# EAGLE design LED7R (EAGLE 5.04)
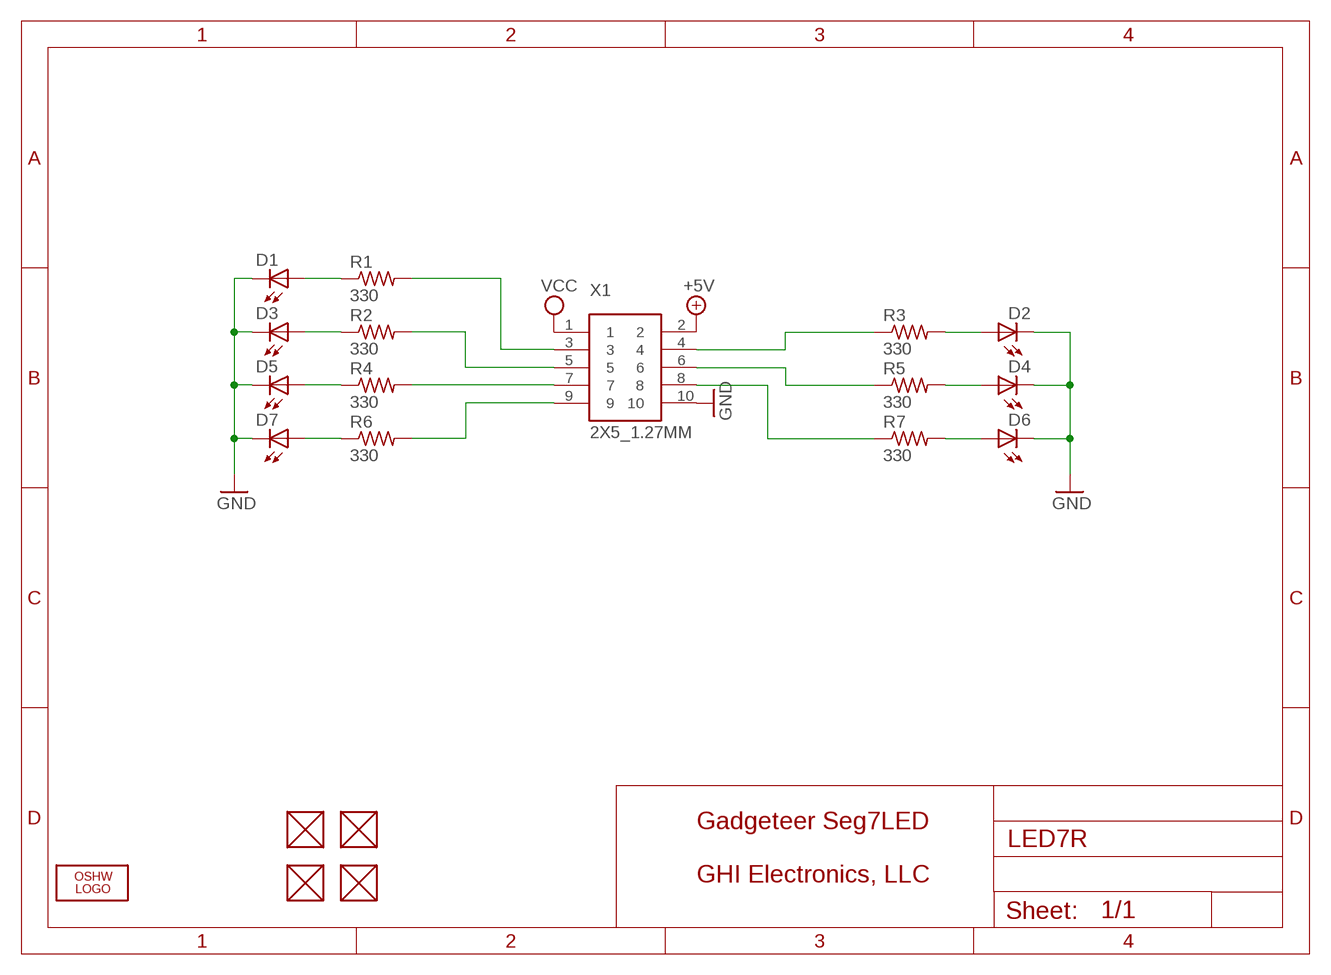
[diagram p0: schematic, sheet 1]

## Parts
D1  LEDCHIPLED_0805  [CHIPLED_0805]
D2  LEDCHIPLED_0805  [CHIPLED_0805]
D3  LEDCHIPLED_0805  [CHIPLED_0805]
D4  LEDCHIPLED_0805  [CHIPLED_0805]
D5  LEDCHIPLED_0805  [CHIPLED_0805]
D6  LEDCHIPLED_0805  [CHIPLED_0805]
D7  LEDCHIPLED_0805  [CHIPLED_0805]
FUD1  FIDUCIAL  [FIDUCIAL_40MIL]
FUD2  FIDUCIAL  [FIDUCIAL_40MIL]
FUD5  FIDUCIAL  [FIDUCIAL_40MIL]
FUD6  FIDUCIAL  [FIDUCIAL_40MIL]
LOGO1  LOGO-OSHW-FILLX0200-NT  [OSHW_FILLX200_NOTEXT]
R1  330  R-US_R0603  [R0603]
R2  330  R-US_R0603  [R0603]
R3  330  R-US_R0603  [R0603]
R4  330  R-US_R0603  [R0603]
R5  330  R-US_R0603  [R0603]
R6  330  R-US_R0603  [R0603]
R7  330  R-US_R0603  [R0603]
X1  2X5_1.27MM  [2X5_1.27MM]

## Nets
+5V [power]: X1.2
GND [power]: D1.C D2.C D3.C D4.C D5.C D6.C D7.C X1.10
N$1: D6.A R7.2
N$2: D4.A R5.2
N$3: D2.A R3.2
N$4: D5.A R4.1
N$5: D3.A R2.1
N$6: D7.A R6.1
N$7: D1.A R1.1
N$8: R1.2 X1.3
N$9: R2.2 X1.5
N$10: R4.2 X1.7
N$11: R6.2 X1.9
N$12: R3.1 X1.4
N$13: R5.1 X1.6
N$14: R7.1 X1.8
VCC [power]: X1.1
Unconnected: FUD1.P$1 FUD2.P$1 FUD5.P$1 FUD6.P$1

## Notes on the sheet
- Gadgeteer Seg7LED
- GHI Electronics, LLC

## Library data of the parts
D1-D7 = led:LED: LED OSRAM: - CHIPLED LG R971, LG N971, LY N971, LG Q971, LY Q971, LO R971, LY R971 LH N974, LH R974 LS Q976, LO Q976, LY Q976 LO Q996 - Hyper CHIPLED LW Q18S LB Q993, LB Q99A, LB R99A - SideLED LS A670, LO A670, LY A670, LG A670, LP A670 LB A673, LV A673, LT A673, LW A673 LH A674 LY A675 LS A676, LA A676, LO A676, LY A676, LW A676 LS A679, LY A679, LG A679 - Hyper Micro SIDELED® LS Y876, LA Y876, LO Y876, LY Y876 LT Y87S - SmartLED LW L88C, LW L88S LB L89C, LB L89S, LG L890 LS L89K, LO L89K, LY L89K LS L896, LA L896, LO L896, LY L896 - TOPLED LS T670, LO T670, LY T670, LG T670, LP T670 LSG T670, LSP T670, LSY T670, LOP T670, LYG T670 LG T671, LOG T671, LSG T671 LB T673, LV T673, LT T673, LW T673 LH T674 LS T676, LA T676, LO T676, LY T676, LB T676, LH T676, LSB T676, LW T676 LB T67C, LV T67C, LT T67C, LS T67K, LO T67K, LY T67K, LW E67C LS E67B, LA E67B, LO E67B, LY E67B, LB E67C, LV E67C, LT E67C LW T67C LS T679, LY T679, LG T679 LS T770, LO T770, LY T770, LG T770, LP T770 LB T773, LV T773, LT T773, LW T773 LH T774 LS E675, LA E675, LY E675, LS T675 LS T776, LA T776, LO T776, LY T776, LB T776 LHGB T686 LT T68C, LB T68C - Hyper Mini TOPLED® LB M676 - Mini TOPLED Santana® LG M470 LS M47K, LO M47K, LY M47K Source: http://www.osram.convergy.de LUXEON: - LUMILED® LXK2-PW12-R00, LXK2-PW12-S00, LXK2-PW14-U00, LXK2-PW14-V00 LXK2-PM12-R00, LXK2-PM12-S00, LXK2-PM14-U00 LXK2-PE12-Q00, LXK2-PE12-R00, LXK2-PE12-S00, LXK2-PE14-T00, LXK2-PE14-U00 LXK2-PB12-K00, LXK2-PB12-L00, LXK2-PB12-M00, LXK2-PB14-N00, LXK2-PB14-P00, LXK2-PB14-Q00 LXK2-PR12-L00, LXK2-PR12-M00, LXK2-PR14-Q00, LXK2-PR14-R00 LXK2-PD12-Q00, LXK2-PD12-R00, LXK2-PD12-S00 LXK2-PH12-R00, LXK2-PH12-S00 LXK2-PL12-P00, LXK2-PL12-Q00, LXK2-PL12-R00 Source: www.luxeon.com KINGBRIGHT: KA-3528ASYC Source: www.kingbright.com
FUD1 FUD2 FUD5 FUD6 = GHI:FIDUCIAL
LOGO1 = Logo:LOGO-OSHW-FILL
R1-R7 = rcl:R-US_: RESISTOR, American symbol
X1 = GHI:2X5_1.27MM

## Net classes
0 default: width 0.254 mm, drill 0.381 mm, clearance 0.203 mm

## Board
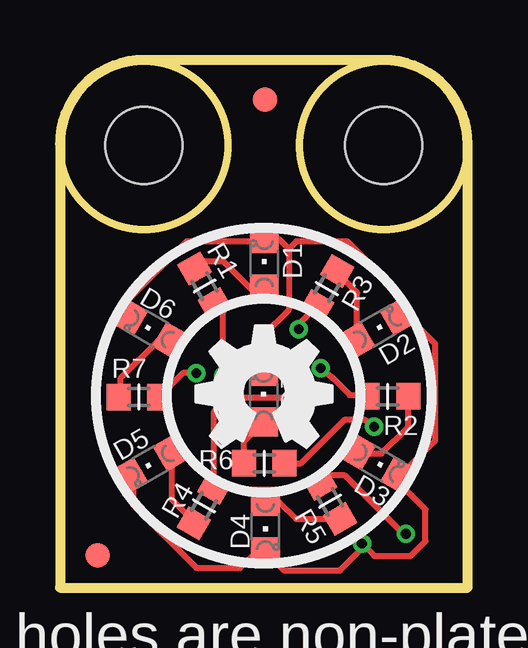
[diagram p1: board, top side]
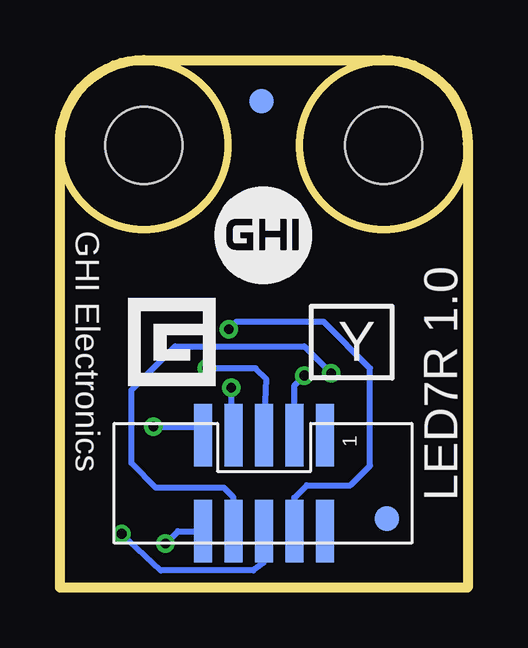
[diagram p2: board, bottom side, seen from below]

Size 17 x 22 mm. Coordinates in mm from the lower left corner, seen from the top.
Outline: 0,0 17,0 17,18.5 arc90 13.5,22 3.5,22 arc90 0,18.5 0,0
Outline: circle at 3.5,18.44 radius 3.5
Outline: circle at 13.5,18.44 radius 3.5
Copper layers (1+16): Top 0.035mm / dielectric 1.5mm / Bottom 0.035mm
Design rules "default *": minimum track width 8mil, minimum drill 12mil, track to track 8mil, track to pad 8mil, pad to pad 8mil, via to via 8mil, smd to smd 8mil, copper to edge 15mil, drill to drill 8mil, minimum pad ring 10mil, minimum via ring 7mil, stop-mask expansion 4mil, vias tented up to drill 50mil, thermal gap 10mil
Holes 3.2 mm at 13.5,18.44 3.5,18.44

### Footprints (pad centres in the part's own frame; a part is rotated, then mirrored left to right if it is on the bottom)
CHIPLED_0805 = smd 1.2 x 1.2: A 0,-1.05; C 0,1.05
FIDUCIAL_40MIL = smd 1.016 x 1.016: P$1 0,0
R0603 = smd 1 x 1.1: 1 -0.85,0; 2 0.85,0
2X5_1.27MM = smd 2.6 x 0.74: 1 -2,2.58; 2 2,2.58; 3 -2,1.31; 4 2,1.31; 5 -2,0.04; 6 2,0.04; 7 -2,-1.23; 8 2,-1.23; 9 -2,-2.5; 10 2,-2.5

### Placement (x,y rotation side)
D1  8.52,13.5 0 top
D2  13.24,10.8 300 top
D3  13.26,5.18 240 top
D4  8.57,2.54 180 top
D5  3.77,5.14 120 top
D6  3.76,10.79 60 top
D7  8.49,7.96 0 top
FUD1  8.55,20.34 0 top
FUD2  1.58,1.34 0 top
FUD5  8.59,20.29 0 bottom
FUD6  3.37,2.88 0 bottom
LOGO1  5.67,5.83 0 top
R1  6.03,12.57 300 top
R2  13.67,7.97 180 top
R3  11.14,12.47 60 top
R4  6.01,3.41 60 top
R5  11.27,3.59 300 top
R6  8.52,5.18 0 top
R7  3.29,7.94 180 top
X1  8.53,4.35 270 bottom

### Tracks (layer width: path | path; a pad name or v marks a point on that pad's centre or on a via)
GND  (via drill 0.41)
  Top 0.254: D5.C 3.05,4.43 3.05,3.45 5.69,0.81 7.52,0.81 8.2,1.49 D4.C 9.35,0.71 11.68,0.71 12.6,1.63 v12.6,1.83 13.11,1.32 14.63,1.32 15.24,1.93 15.24,3.25 14.17,4.32 D3.C 15.65,6.13 15.65,10.16 14.48,11.32 D2.C 14.15,12.27 11.99,14.43 9.86,14.43 9.55,14.12 | D7.C 8.49,10.53 9.55,11.58 9.55,14.12 | 9.55,14.12 9.14,14.53 8.54,14.53 D1.C 8.4,14.43 5.28,14.43 2.85,12 D6.C
  Bottom 0.254: X1.10 12.08,2.35 v12.6,1.83
N$1
  Top 0.254: D6.A 4.07,10.26 2.54,8.74 2.54,8.04 R7.2
N$2
  Top 0.254: R5.2 9.84,2.86 9.14,3.56 8.61,3.56 D4.A
N$3
  Top 0.254: R3.2 11.56,13.13 12.39,12.29 12.39,10.34 D2.A
N$4
  Top 0.254: R4.1 5.58,2.75 4.67,3.66 D5.A
N$5
  Top 0.254: R2.1 14.52,6.7 13.41,5.59 12.47,5.59 D3.A
N$6
  Top 0.254: R6.1 7.67,6.08 D7.A
N$7
  Top 0.254: D1.A 7.97,12.45 6.81,13.61 5.92,13.61 R1.1
N$8  (via drill 0.41)
  Top 0.254: v6.81,8.84 6.81,11.48 R1.2
  Bottom 0.254: X1.3 7.22,8.42 v6.81,8.84
N$9  (via drill 0.41)
  Top 0.254: v10.87,9.14 11.38,8.74 12.09,8.03 12.77,8.03 R2.2
  Bottom 0.254: X1.5 8.39,8.7 8.84,9.14 v10.87,9.14
N$10  (via drill 0.41)
  Top 0.254: R4.2 6.43,7.35 7.01,7.92 9.55,7.92 10.06,8.33 v9.86,8.33
  Bottom 0.254: v9.86,8.33 9.86,6.44 X1.7
N$11  (via drill 0.41)
  Top 0.254: R6.2 10.06,5.18 11.89,7.01 12.7,7.01 v13.11,6.71
  Bottom 0.254: v13.11,6.71 11.28,6.71 11.07,6.5 11.29,6.6 X1.9
N$12  (via drill 0.41)
  Top 0.254: v9.96,10.77 9.96,10.98 R3.1
  Bottom 0.254: X1.4 7.22,3.75 6.71,4.27 4.88,4.27 4.06,5.08 4.06,9.14 5.99,11.07 9.65,11.07 v9.96,10.77
N$13  (via drill 0.41)
  Top 0.254: v14.43,2.23 14.33,2.23 11.89,4.67 11.19,4.67 R5.1
  Bottom 0.254: X1.6 8.49,1.06 8.94,0.71 12.8,0.71 v14.43,2.23
N$14  (via drill 0.41)
  Top 0.254: v5.69,8.94 5.14,8.94 R7.1
  Bottom 0.254: X1.8 9.76,3.77 10.16,4.17 13.01,4.17 14.02,5.18 14.02,5.38 14.02,8.23 12.19,10.06 6.81,10.06 v5.69,8.94

### Text on the board
tPlace: corner holes are non-plated | Black PCB with white print | Do not add any manufacturing Code!
bPlace: GHI Electronics | Y | LED7R 1.0